# Altium schematic sheet meter_channel.SchDoc
size A4
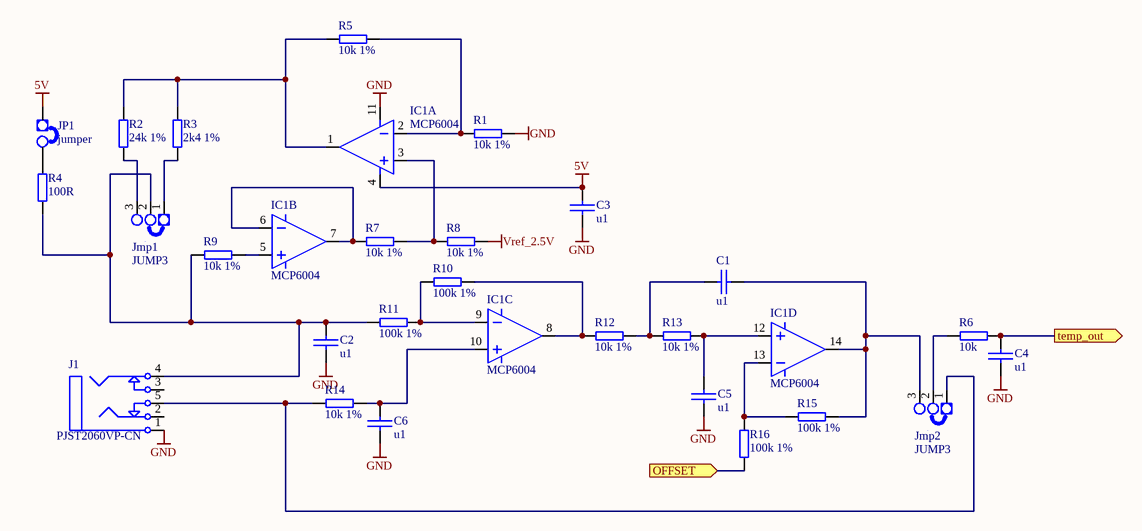
[diagram p0: meter_channel.SchDoc]

## Parts
C1  u1  [0603C]
C2  u1  [0603C]
C3  u1  [0603C]
C4  u1  [0603C]
C5  u1  [0603C]
C6  u1  [0603C]
IC1  MCP6004  [TSSOP14-4.4]  (parts A,B,C,D of 4)
J1  PJST2060VP-CN  [ST-3150-5N]
Jmp1  JUMP3  [jump3]
Jmp2  JUMP3  [jump3]
JP1  jumper  [jump]
R1  10k 1%  [0603R]
R2  24k 1%  [0603R]
R3  2k4 1%  [0603R]
R4  100R  [0603R]
R5  10k 1%  [0603R]
R6  10k  [0603R]
R7  10k 1%  [0603R]
R8  10k 1%  [0603R]
R9  10k 1%  [0603R]
R10  100k 1%  [0603R]
R11  100k 1%  [0603R]
R12  10k 1%  [0603R]
R13  10k 1%  [0603R]
R14  10k 1%  [0603R]
R15  100k 1%  [0603R]
R16  100k 1%  [0603R]

## Ports
OFFSET (in), temp_out (out)

## Nets
5V: C3.1 IC1.4 JP1.1(E1)
GND: C2.2 C3.2 C4.1 C5.1 C6.2 IC1.11 J1.1 R1.1
Vref_2.5V: R8.2
OFFSET: R16.1 ; port OFFSET
temp_out: C4.2 R6.1 ; port temp_out
NetC1_1: C1.1 R12.2 R13.1
NetC1_2: C1.2 IC1.14 Jmp2.3 R15.2
NetC2_1: C2.1 J1.4 Jmp1.2 R4.2 R9.1 R11.1
NetC5_2: C5.2 IC1.12 R13.2
NetC6_1: C6.1 IC1.10 R14.2
NetIC1_1: IC1.1 R2.1 R3.1 R5.2
NetIC1_2: IC1.2 R1.2 R5.1
NetIC1_3: IC1.3 R7.2 R8.1
NetIC1_5: IC1.5 R9.2
NetIC1_6: IC1.6 IC1.7 R7.1
NetIC1_8: IC1.8 R10.2 R12.1
NetIC1_9: IC1.9 R10.1 R11.2
NetIC1_13: IC1.13 R15.1 R16.2
NetJ1_5: J1.5 Jmp2.1 R14.1
NetJmp1_1: Jmp1.1 R3.2
NetJmp1_3: Jmp1.3 R2.2
NetJmp2_2: Jmp2.2 R6.2
NetJP1_2: JP1.2(E2) R4.1

Not connected (* = marked no-connect by the designer): J1 2 3

## Library data of the parts
C1-C6 = CAP_SMD: Capacitor SMD
IC1 = OA_MCP6004: micropower opamp
J1 = CON_Phonejack Stereo SW: 3-Conductor Jack with 2 break contacts (normals) and 2 auxiliary make contacts; Revision 1: 17-Jul-2002: Re-released for DXP Platform.; Revision 2: 17-Dec-2003: PCB Footprint replaced.; Published: 5-Jan-2004; Datasheet: Latest Revision: 07-Mar-2000; Publisher: Altium Limited
R1-R16 = RES2: Resistor